# Altium schematic sheet AMU-S11-V00-AMSPROFET.SchDoc
size A3; DocumentNumber: 12; SheetNumber: 10; SheetTotal: 25; Version: 00; Project: ####; PageSetup: Record=PageOptions|CenterHorizontal=True|CenterVertical=True|PrintScale=0.97|XCorrection=1.00|YCorrection=1.00|PrintKind=0|BorderSize=5000000|LeftOffset=0|BottomOffset=0|Orientation=2|PaperLength=1000|PaperWidth=1000|Scale=100|PaperSource=7|PrintQuality=-4|MediaType=1|DitherType=10|PaperKind=A4|PrintScaleMode=1
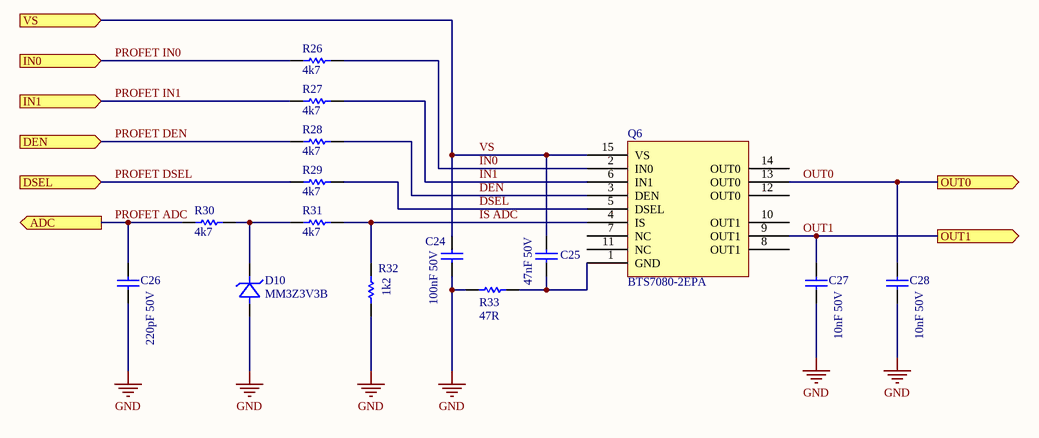
[diagram p0: AMU-S11-V00-AMSPROFET.SchDoc]

## Parts
C24  100nF 50V  [Cap_Ceramic_0603]
C25  47nF 50V  [Cap_Ceramic_0603]
C26  220pF 50V  [Cap_Ceramic_0603]
C27  10nF 50V  [Cap_Ceramic_0603]
C28  10nF 50V  [Cap_Ceramic_0603]
D10  MM3Z3V3B  [SOD-323F]
Q6  BTS7080-2EPA  [BTS7008-2EPZ]
R26  4k7  [Res_ThinFilm_0603]
R27  4k7  [Res_ThinFilm_0603]
R28  4k7  [Res_ThinFilm_0603]
R29  4k7  [Res_ThinFilm_0603]
R30  4k7  [Res_ThinFilm_0603]
R31  4k7  [Res_ThinFilm_0603]
R32  1k2  [Res_ThinFilm_0603]
R33  47R  [Res_ThinFilm_0603]

## Ports
ADC (out), DEN (in), DSEL (in), IN0 (in), IN1 (in), OUT0 (out), OUT1 (out), VS (in)

## Nets
GND: C24.1 C26.1 C27.2 C28.2 D10.1(Anode) R32.1 R33.1
DEN: Q6.3(DEN) R28.2
DSEL: Q6.5(DSEL) R29.2
IN0: Q6.2(IN0) R26.2
IN1: Q6.6(IN1) R27.2
IS ADC: Q6.4(IS) R31.2 R32.2
OUT0: C28.1 Q6.13(OUT0) ; port OUT0
OUT1: C27.1 Q6.9(OUT1) ; port OUT1
PROFET ADC: C26.2 R30.1 ; port ADC
PROFET DEN: R28.1 ; port DEN
PROFET DSEL: R29.1 ; port DSEL
PROFET IN0: R26.1 ; port IN0
PROFET IN1: R27.1 ; port IN1
VS: C24.2 C25.2 Q6.15(VS) ; port VS
NetC25_1: C25.1 Q6.1(GND) R33.2
NetD10_2: D10.2(Cathode) R30.2 R31.1

Not connected (* = marked no-connect by the designer): Q6 7(NC) 8(OUT1) 10(OUT1) 11(NC) 12(OUT0) 14(OUT0)

## Notes on the sheet
- Revision History:
- Sheet Title:
- Rev
- Date
- Description
- Project:
- Size:
- Drawn By:
- A3
- Number:
- Revision:
- Sheet
- Version:
- of
- QUT Motorsport
- O-120, Gardens Point
- 2 George Street
- Brisbane, QLD 4000
- Australia
- Print Date:
- Print Time:
- File Name:

## Library data of the parts
C24 = 100nF 50V 5% X7R 0603: Capacitor, Ceramic, SMD, 100nF, 50V, 5%, X7R, 0603
C25 = 47nF 50V 10% X7R 0603: 0.047µF ±10% 50V Ceramic Capacitor X7R 0603 (1608 Metric); ComponentLink1Description: Digikey; ComponentLink1URL: https://www.digikey.com.au/product-detail/en/kemet/C0603C473K5RACTU/399-7933-1-ND/3471656; ComponentLink2Description: Datasheet; ComponentLink2URL: https://content.kemet.com/datasheets/KEM_C1002_X7R_SMD.pdf
C26 = 220pF 50V 5% 0603: 220pF ±5% 50V Ceramic Capacitor C0G, NP0 0603 (1608 Metric); ComponentLink1Description: Digikey; ComponentLink1URL: https://www.digikey.com.au/product-detail/en/kemet/C0603C221J5GACTU/399-1066-1-ND/411341; ComponentLink2Description: Datasheet; ComponentLink2URL: https://content.kemet.com/datasheets/KEM_C1003_C0G_SMD.pdf
C27 C28 = 10nF 50V 20% X7R 0603: 10000pF ±20% 50V Ceramic Capacitor X7R 0603 (1608 Metric); ComponentLink1Description: Digikey; ComponentLink1URL: https://www.digikey.com.au/product-detail/en/kemet/C0603C103M5RACTU/399-7842-1-ND/3471565; ComponentLink2Description: Datasheet; ComponentLink2URL: https://content.kemet.com/datasheets/KEM_C1002_X7R_SMD.pdf
D10 = MM3Z3V3B: Zener Diode 3.3V 200mW ±2% Surface Mount SOD-323F; Manufacturer: ON Semiconductor; MPN: MM3Z56VB; ComponentLink1Description: Digikey; ComponentLink1URL: https://www.digikey.com.au/product-detail/en/on-semiconductor/MM3Z3V3B/MM3Z3V3BCT-ND/1626881; ComponentLink2Description: Datasheet; ComponentLink2URL: https://www.onsemi.com/pub/Collateral/MM3Z9V1B-D.pdf
R26-R31 = 4k7 5% 0603: Resistor, SMD, 4k7, 0.1W, 5%, 0603
R32 = 1k2 5% 0603: Resistor, SMD, 1k2, 0.1W, 5%, 0603
R33 = 47R 5% 0603: Resistor, SMD, 47R, 0.1W, 5%, 0603
Q6 = BTS7080-2EPA: ComponentLink1Description: Infineon; ComponentLink1URL: https://www.infineon.com/cms/en/product/power/smart-low-side-high-side-switches/high-side-switches/profet-plus-2-12v-automotive-smart-high-side-switch/bts7080-2epa/; ComponentLink2Description: Datasheet; ComponentLink2URL: https://www.infineon.com/dgdl/Infineon-BTS7080-2EPA-DataSheet-v01_06-EN.pdf?fileId=5546d4625e763904015e941bf21e2dbe